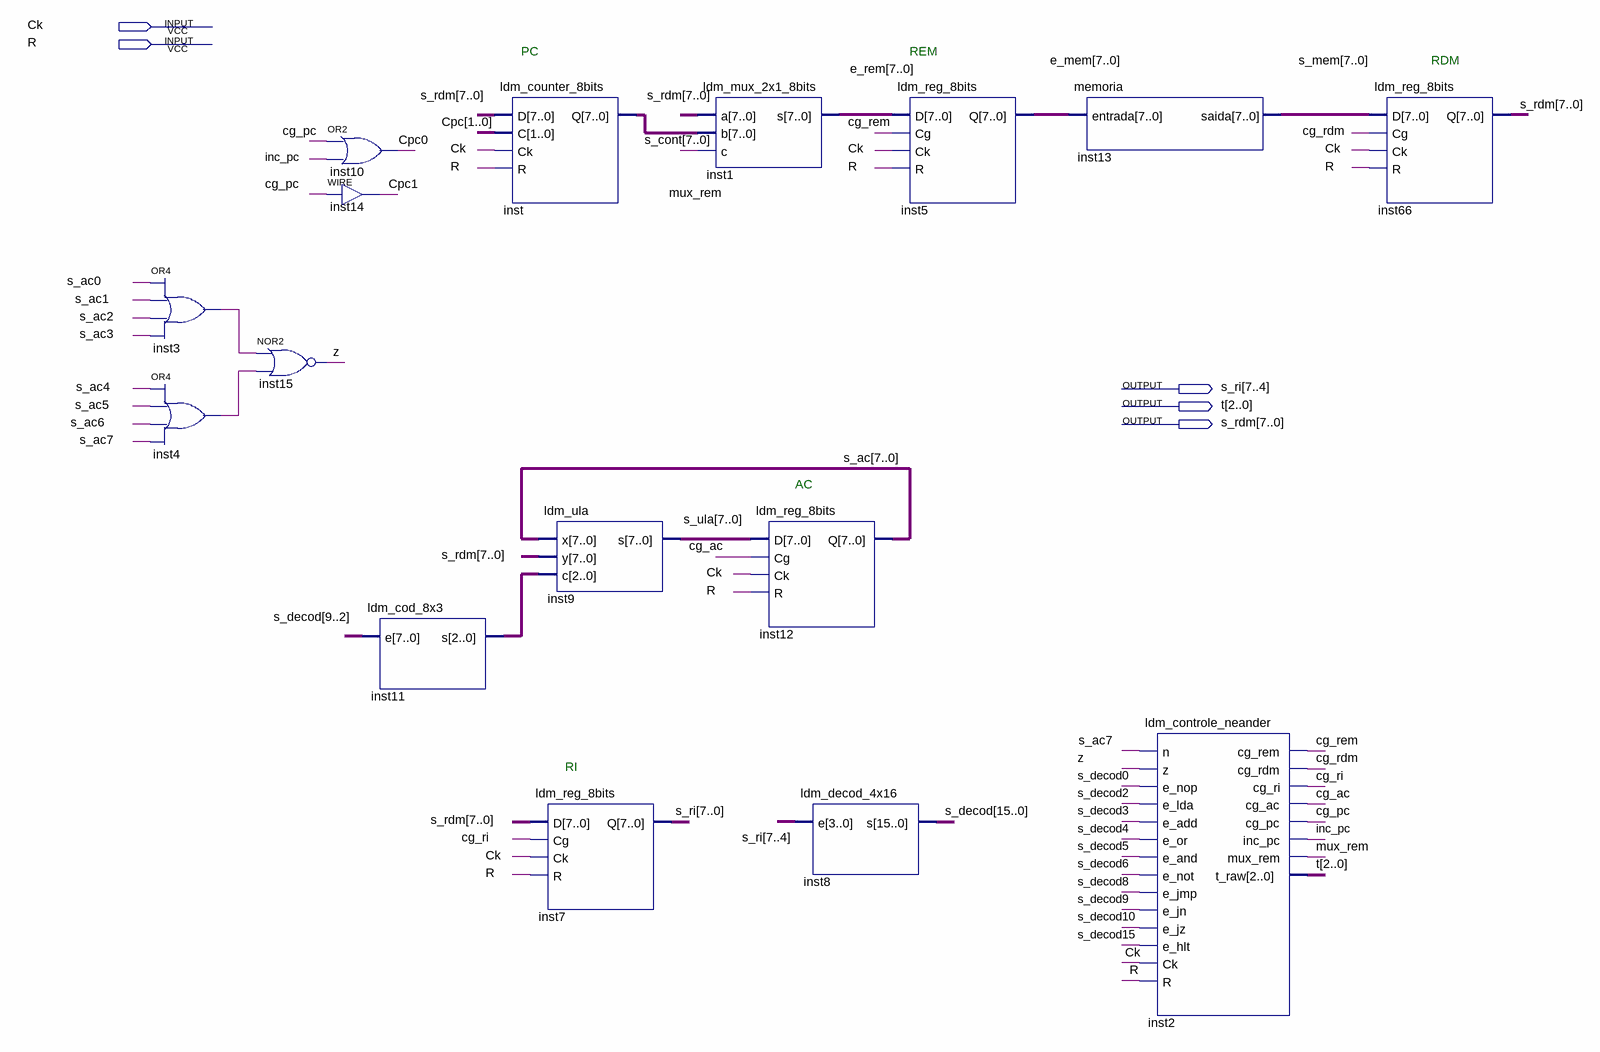
[diagram p0: schematic sheet]
// Quartus schematic ldm_neander.bdf as structural Verilog: 16 symbols, 5 pins
module ldm_neander (
  input  Ck,
  input  R,
  output [7:0] s_ri,
  output [2:0] t,
  output [7:0] s_rdm
);

  wire cg_ac, cg_pc, cg_rdm, cg_rem, cg_ri, inc_pc, inst3_out, inst4_out, mux_rem, z;
  wire [1:0] Cpc;
  wire [2:0] inst11_s;
  wire [7:0] e_mem, e_rem, s_ac, s_cont, s_mem, s_ula;
  wire [15:0] s_decod;

  or inst3 (inst3_out, s_ac[0], s_ac[1], s_ac[2], s_ac[3]);
  or inst4 (inst4_out, s_ac[4], s_ac[5], s_ac[6], s_ac[7]);
  nor inst15 (z, inst3_out, inst4_out);
  or inst10 (Cpc[0], cg_pc, inc_pc);
  assign Cpc[1] = cg_pc;  // WIRE inst14
  ldm_cod_8x3 inst11 (.e(s_decod[9:2]), .s(inst11_s));
  ldm_counter_8bits inst (.D(s_rdm), .C(Cpc), .Ck(Ck), .R(R), .Q(s_cont));
  ldm_ula inst9 (.x(s_ac), .y(s_rdm), .c(inst11_s), .s(s_ula));
  ldm_reg_8bits inst7 (.D(s_rdm), .Cg(cg_ri), .Ck(Ck), .R(R), .Q(s_ri));
  ldm_mux_2x1_8bits inst1 (.a(s_rdm), .b(s_cont), .c(mux_rem), .s(e_rem));
  ldm_reg_8bits inst12 (.D(s_ula), .Cg(cg_ac), .Ck(Ck), .R(R), .Q(s_ac));
  ldm_decod_4x16 inst8 (.e(s_ri[7:4]), .s(s_decod));
  ldm_reg_8bits inst5 (.D(e_rem), .Cg(cg_rem), .Ck(Ck), .R(R), .Q(e_mem));
  memoria inst13 (.entrada(e_mem), .saida(s_mem));
  ldm_controle_neander inst2 (
    .n(s_ac[7]), .z(z), .e_nop(s_decod[0]), .e_lda(s_decod[2]), .e_add(s_decod[3]), .e_or(s_decod[4]),
    .e_and(s_decod[5]), .e_not(s_decod[6]), .e_jmp(s_decod[8]), .e_jn(s_decod[9]), .e_jz(s_decod[10]),
    .e_hlt(s_decod[15]), .Ck(Ck), .R(R), .cg_rem(cg_rem), .cg_rdm(cg_rdm), .cg_ri(cg_ri), .cg_ac(cg_ac),
    .cg_pc(cg_pc), .inc_pc(inc_pc), .mux_rem(mux_rem), .t_raw(t));
  ldm_reg_8bits inst66 (.D(s_mem), .Cg(cg_rdm), .Ck(Ck), .R(R), .Q(s_rdm));

  // Notes on the sheet:
  //   PC
  //   REM
  //   RDM
  //   AC
  //   RI
endmodule
